# EAGLE schematic Vers. 5 Moppy Board (EAGLE 9.1.3)
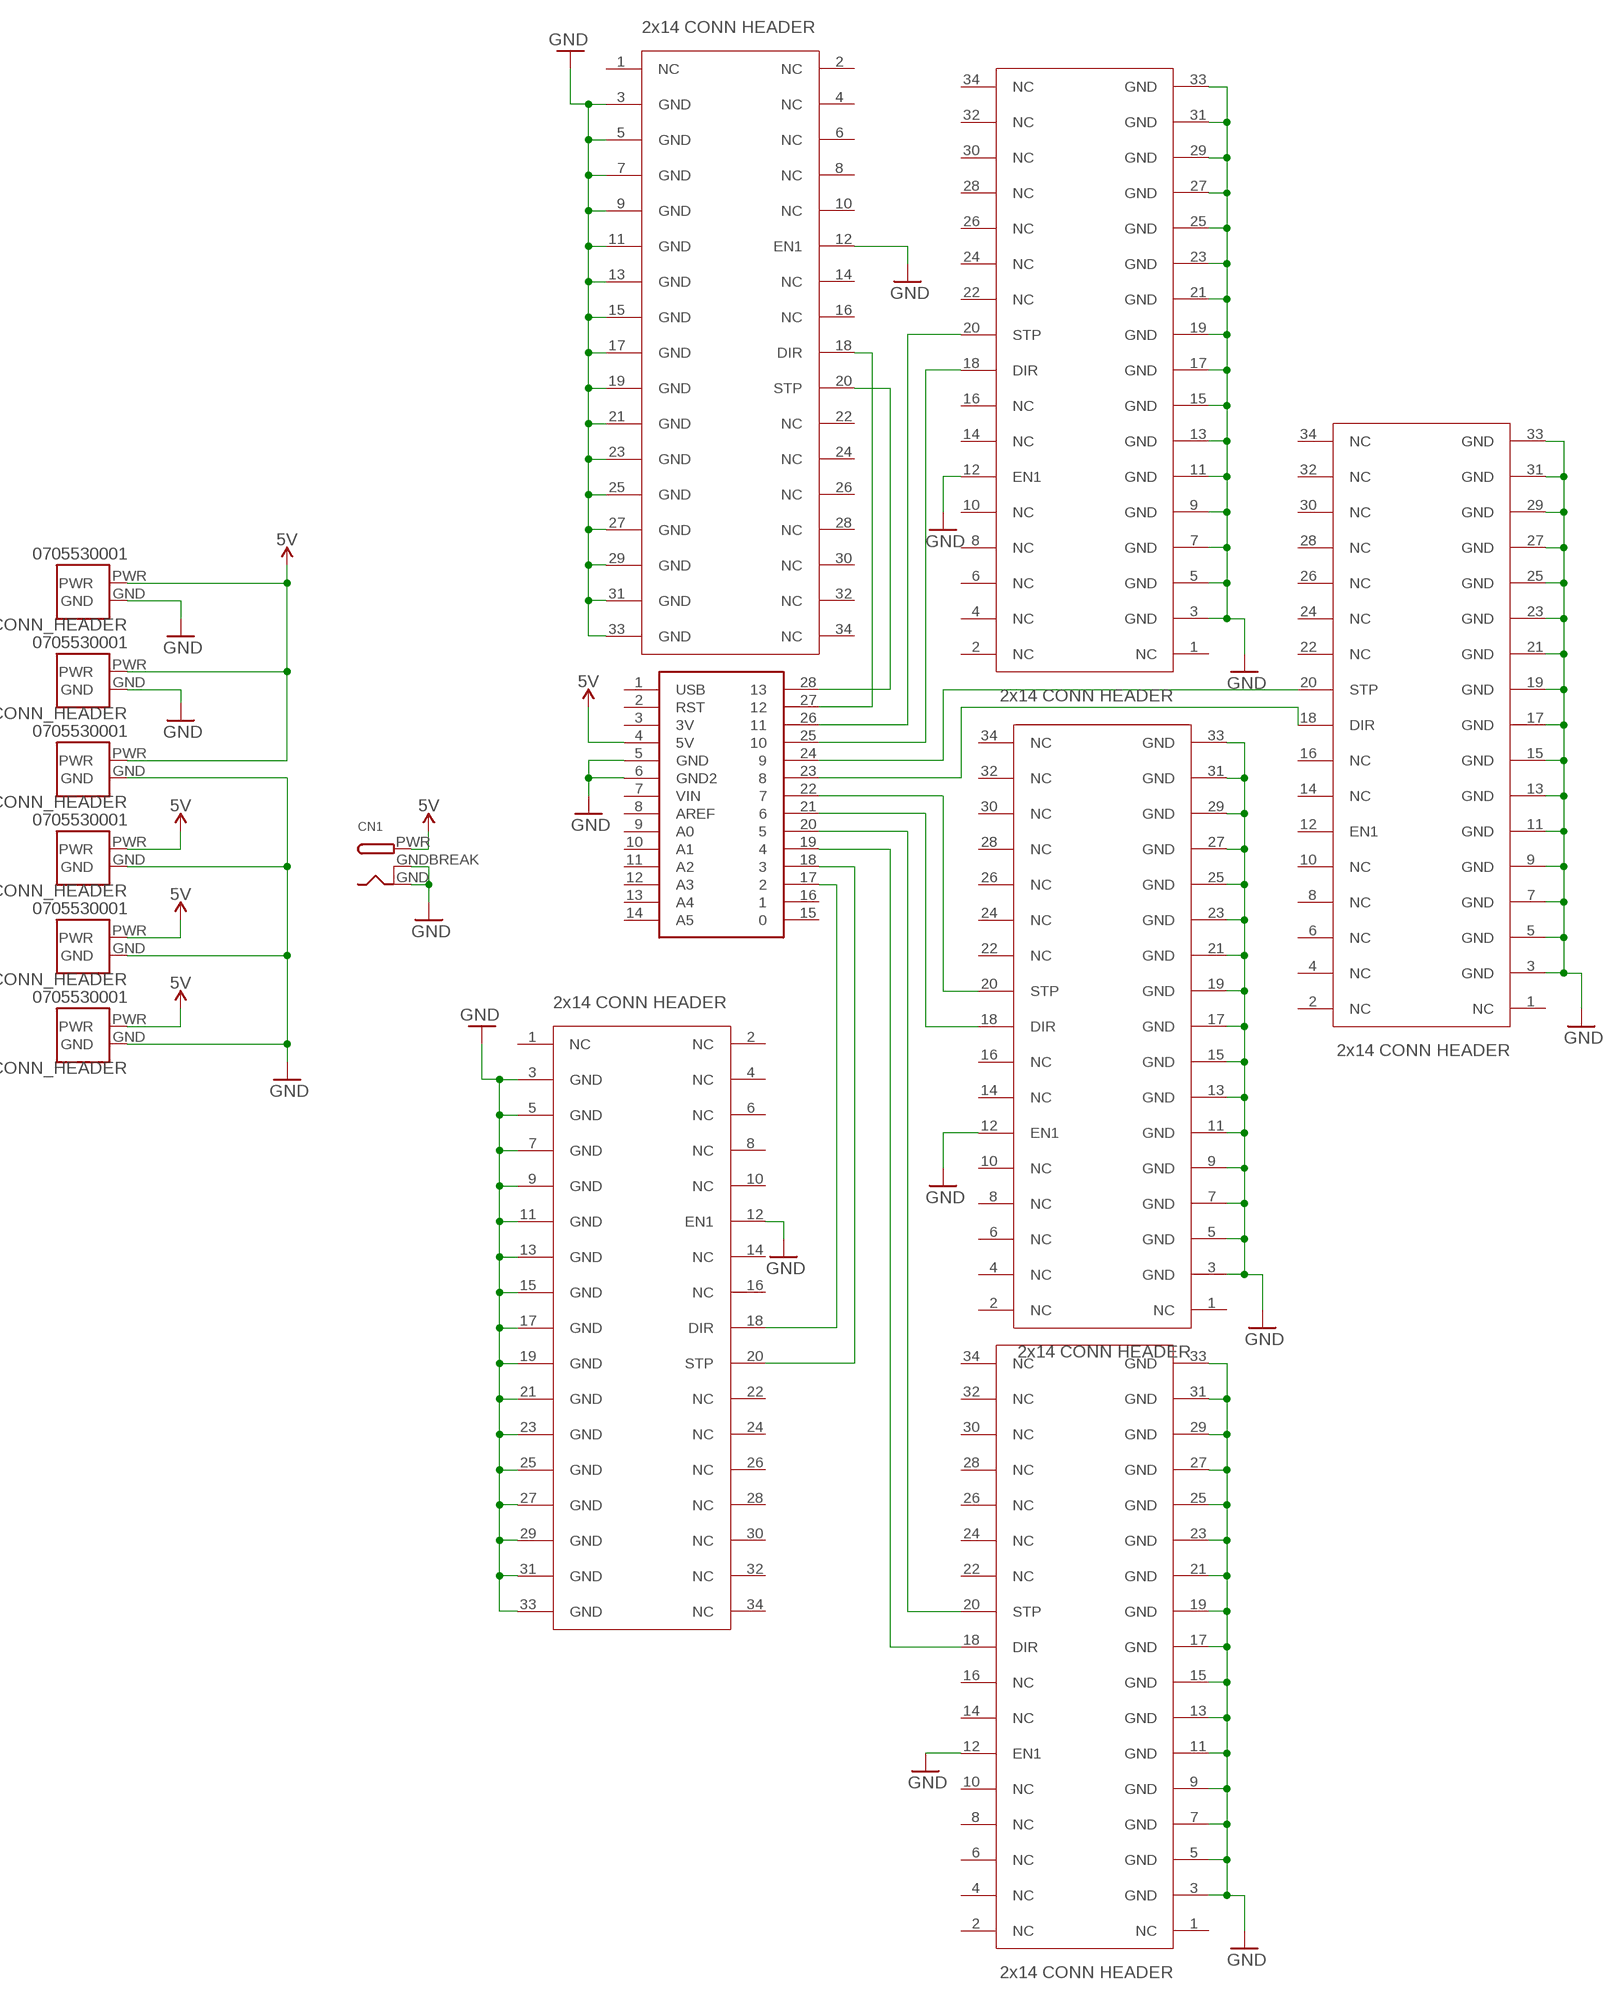
[diagram p0: schematic, sheet 1]

## Parts
CN1  DCBARRELPTH  [DCJACK_2MM_PTH]
U$1  2X14_CONN_HEADER  [2X17_CONN_HEADER]
U$2  2X14_CONN_HEADER  [2X17_CONN_HEADER]
U$3  2X14_CONN_HEADER  [2X17_CONN_HEADER]
U$4  2X14_CONN_HEADER  [2X17_CONN_HEADER]
U$5  2X14_CONN_HEADER  [2X17_CONN_HEADER]
U$6  2X14_CONN_HEADER  [2X17_CONN_HEADER]
U$8  METROMINI  [METROMINI]
X1  0705530001  [MOLEX_0705530001]
X2  0705530001  [MOLEX_0705530001]
X3  0705530001  [MOLEX_0705530001]
X4  0705530001  [MOLEX_0705530001]
X5  0705530001  [MOLEX_0705530001]
X6  0705530001  [MOLEX_0705530001]

## Nets
5V: CN1.PWR U$8.4(5V) X1.PWR X2.PWR X3.PWR X4.PWR X5.PWR X6.PWR
GND: CN1.GND CN1.GNDBREAK U$1.3(GND) U$1.5(GND) U$1.7(GND) U$1.9(GND) U$1.11(GND) U$1.12(EN1) U$1.13(GND) U$1.15(GND) U$1.17(GND) U$1.19(GND) U$1.21(GND) U$1.23(GND) U$1.25(GND) U$1.27(GND) U$1.29(GND) U$1.31(GND) U$1.33(GND) U$2.3(GND) U$2.5(GND) U$2.7(GND) U$2.9(GND) U$2.11(GND) U$2.12(EN1) U$2.13(GND) U$2.15(GND) U$2.17(GND) U$2.19(GND) U$2.21(GND) U$2.23(GND) U$2.25(GND) U$2.27(GND) U$2.29(GND) U$2.31(GND) U$2.33(GND) U$3.3(GND) U$3.5(GND) U$3.7(GND) U$3.9(GND) U$3.11(GND) U$3.12(EN1) U$3.13(GND) U$3.15(GND) U$3.17(GND) U$3.19(GND) U$3.21(GND) U$3.23(GND) U$3.25(GND) U$3.27(GND) U$3.29(GND) U$3.31(GND) U$3.33(GND) U$4.3(GND) U$4.5(GND) U$4.7(GND) U$4.9(GND) U$4.11(GND) U$4.12(EN1) U$4.13(GND) U$4.15(GND) U$4.17(GND) U$4.19(GND) U$4.21(GND) U$4.23(GND) U$4.25(GND) U$4.27(GND) U$4.29(GND) U$4.31(GND) U$4.33(GND) U$5.3(GND) U$5.5(GND) U$5.7(GND) U$5.9(GND) U$5.11(GND) U$5.12(EN1) U$5.13(GND) U$5.15(GND) U$5.17(GND) U$5.19(GND) U$5.21(GND) U$5.23(GND) U$5.25(GND) U$5.27(GND) U$5.29(GND) U$5.31(GND) U$5.33(GND) U$6.3(GND) U$6.5(GND) U$6.7(GND) U$6.9(GND) U$6.11(GND) U$6.13(GND) U$6.15(GND) U$6.17(GND) U$6.19(GND) U$6.21(GND) U$6.23(GND) U$6.25(GND) U$6.27(GND) U$6.29(GND) U$6.31(GND) U$6.33(GND) U$8.5(GND) U$8.6(GND2) X1.GND X2.GND X3.GND X4.GND X5.GND X6.GND
N$1: U$2.20(STP) U$8.28
N$2: U$2.18(DIR) U$8.27
N$3: U$3.20(STP) U$8.26
N$4: U$3.18(DIR) U$8.25
N$5: U$5.20(STP) U$8.22
N$6: U$5.18(DIR) U$8.21
N$7: U$1.18(DIR) U$8.17
N$8: U$4.18(DIR) U$8.19
N$9: U$1.20(STP) U$8.18
N$10: U$6.20(STP) U$8.24
N$11: U$4.20(STP) U$8.20
N$12: U$6.18(DIR) U$8.23
Unconnected: U$1.1(NC) U$1.2(NC) U$1.4(NC) U$1.6(NC) U$1.8(NC) U$1.10(NC) U$1.14(NC) U$1.16(NC) U$1.22(NC) U$1.24(NC) U$1.26(NC) U$1.28(NC) U$1.30(NC) U$1.32(NC) U$1.34(NC) U$2.1(NC) U$2.2(NC) U$2.4(NC) U$2.6(NC) U$2.8(NC) U$2.10(NC) U$2.14(NC) U$2.16(NC) U$2.22(NC) U$2.24(NC) U$2.26(NC) U$2.28(NC) U$2.30(NC) U$2.32(NC) U$2.34(NC) U$3.1(NC) U$3.2(NC) U$3.4(NC) U$3.6(NC) U$3.8(NC) U$3.10(NC) U$3.14(NC) U$3.16(NC) U$3.22(NC) U$3.24(NC) U$3.26(NC) U$3.28(NC) U$3.30(NC) U$3.32(NC) U$3.34(NC) U$4.1(NC) U$4.2(NC) U$4.4(NC) U$4.6(NC) U$4.8(NC) U$4.10(NC) U$4.14(NC) U$4.16(NC) U$4.22(NC) U$4.24(NC) U$4.26(NC) U$4.28(NC) U$4.30(NC) U$4.32(NC) U$4.34(NC) U$5.1(NC) U$5.2(NC) U$5.4(NC) U$5.6(NC) U$5.8(NC) U$5.10(NC) U$5.14(NC) U$5.16(NC) U$5.22(NC) U$5.24(NC) U$5.26(NC) U$5.28(NC) U$5.30(NC) U$5.32(NC) U$5.34(NC) U$6.1(NC) U$6.2(NC) U$6.4(NC) U$6.6(NC) U$6.8(NC) U$6.10(NC) U$6.12(EN1) U$6.14(NC) U$6.16(NC) U$6.22(NC) U$6.24(NC) U$6.26(NC) U$6.28(NC) U$6.30(NC) U$6.32(NC) U$6.34(NC) U$8.1(USB) U$8.2(RST) U$8.3(3V) U$8.7(VIN) U$8.8(AREF) U$8.9(A0) U$8.10(A1) U$8.11(A2) U$8.12(A3) U$8.13(A4) U$8.14(A5) U$8.15 U$8.16

## Library data of the parts
CN1 = adafruit:DCBARREL: 2.0mm DC Barrel Jack DCJACK_2MM_PTH - Through Hole Jack (4UConnector: 05537)
U$1-U$6 = Danielle's Library:2X14_CONN_HEADER
U$8 = MetroMINI:METROMINI
X1-X6 = 2.54_CONN_HEADER:0705530001: Conn Shrouded Header HDR 2 POS 2.54mm Solder RA Thru-Hole SLÃ¢âÂ¢ Tube; DESCRIPTION: Conn Shrouded Header HDR 2 POS 2.54mm Solder RA Thru-Hole SLÃ¢âÂ¢ Tube; DIGI-KEY_PART_NUMBER: WM4900-ND; DIGI-KEY_PURCHASE_URL: https://www.digikey.com/product-detail/en/molex/0705530001/WM4900-ND/114951?utm_source=snapeda&utm_medium=aggregator&utm_campaign=symbol; MF: Molex; MP: 0705530001; PACKAGE: None